# EAGLE schematic es (EAGLE 6.1)
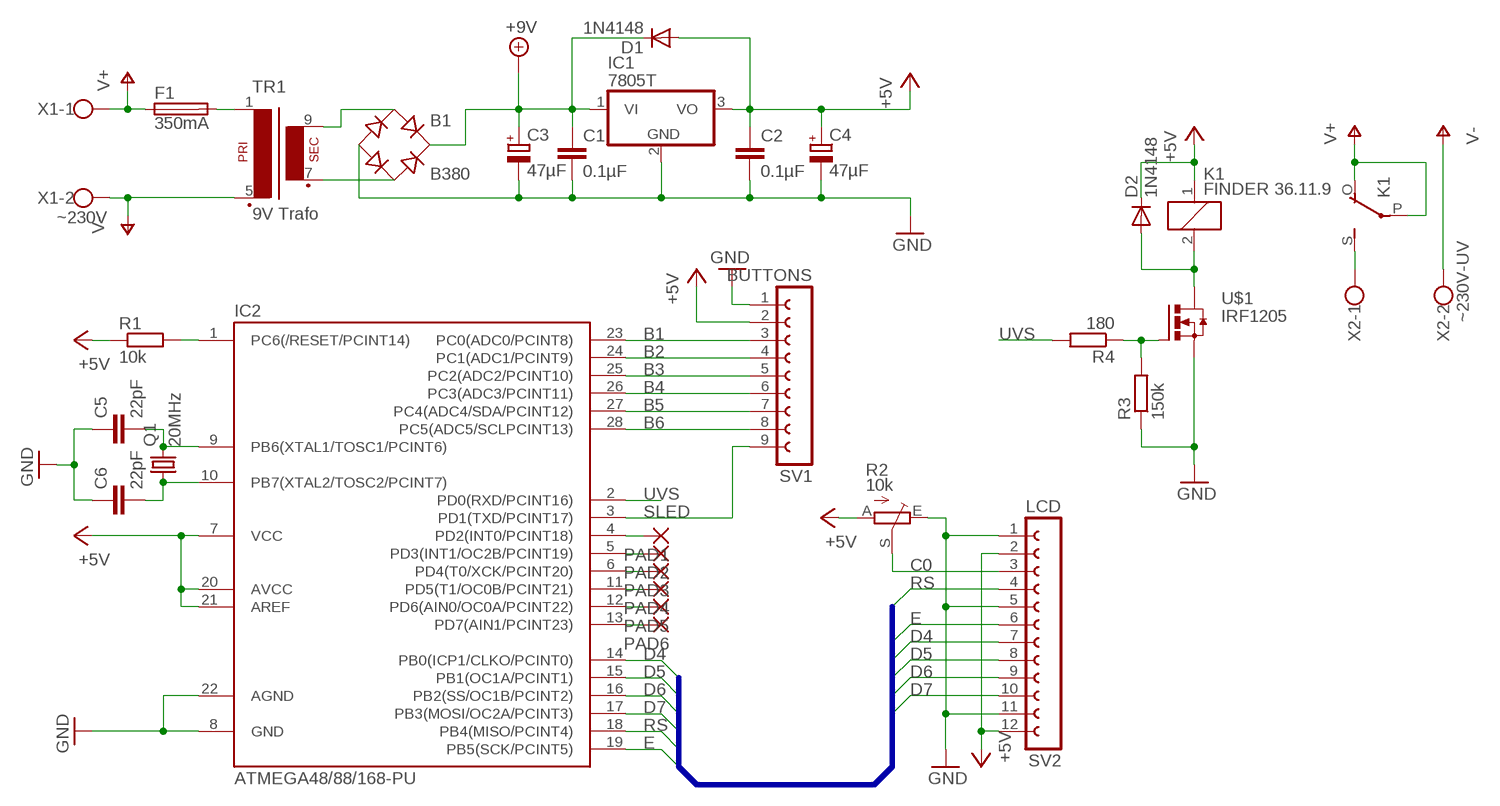
[diagram p0: schematic, sheet 1]

## Parts
B1  B380  RB1A  [RB1A]
C1  0.1µF  C-EU025-024X044  [C025-024X044]
C2  0.1µF  C-EU025-024X044  [C025-024X044]
C3  47µF  CPOL-EUE2.5-5  [E2,5-5]
C4  47µF  CPOL-EUE2.5-5  [E2,5-5]
C5  22pF  C-EU050-024X044  [C050-024X044]
C6  22pF  C-EU050-024X044  [C050-024X044]
D1  1N4148  1N4148DO35-7  [DO35-7]
D2  1N4148  1N4148DO35-7  [DO35-7]
F1  350mA  FUSESHK20Q  [SHK20Q]
IC1  7805T  [TO220H]
IC2  ATMEGA48/88/168-PU  [DIL28-3]
K1  FINDER 36.11.9  G5LE  [G5LE]
PAD1  1,6/0,8  [1,6/0,8]
PAD2  1,6/0,8  [1,6/0,8]
PAD3  1,6/0,8  [1,6/0,8]
PAD4  1,6/0,8  [1,6/0,8]
PAD5  1,6/0,8  [1,6/0,8]
PAD6  1,6/0,8  [1,6/0,8]
Q1  20MHz  CRYSTALHC49S  [HC49/S]
R1  10k  R-EU_0204/7  [0204/7]
R2  10k  TRIM_EU-LI15  [LI15]
R3  150k  R-EU_0204/7  [0204/7]
R4  180  R-EU_0204/7  [0204/7]
SV1  BUTTONS  FE09-1  [FE09]
SV2  LCD  FE12-1  [FE12]
TR1  9V Trafo  EI42-1  [EI42-1]
U$1  IRF1205  [I-PAK_TO251AA]
X1  ~230V  W237-2N  [W237-2N]
X2  ~230V-UV  W237-2N  [W237-2N]

## Nets
+5V: C2.1 C4.+ D1.A D2.C IC1.3(VO) IC2.7(VCC) IC2.20(AVCC) IC2.21(AREF) K1.1 R1.1 R2.A SV1.2 SV2.2 SV2.12
+9V: B1.+ C1.1 C3.+ D1.C IC1.1(VI)
B1: IC2.23(PC0(ADC0/PCINT8)) SV1.3
B2: IC2.24(PC1(ADC1/PCINT9)) SV1.4
B3: IC2.25(PC2(ADC2/PCINT10)) SV1.5
B4: IC2.26(PC3(ADC3/PCINT11)) SV1.6
B5: IC2.27(PC4(ADC4/SDA/PCINT12)) SV1.7
B6: IC2.28(PC5(ADC5/SCLPCINT13)) SV1.8
C0: R2.S SV2.3
D4: IC2.14(PB0(ICP1/CLKO/PCINT0)) SV2.7
D5: IC2.15(PB1(OC1A/PCINT1)) SV2.8
D6: IC2.16(PB2(SS/OC1B/PCINT2)) SV2.9
D7: IC2.17(PB3(MOSI/OC2A/PCINT3)) SV2.10
E: IC2.19(PB5(SCK/PCINT5)) SV2.6
GND: B1.- C1.2 C2.2 C3.- C4.- C5.1 C6.1 IC1.2(GND) IC2.8(GND) IC2.22(AGND) R2.E R3.1 SV1.1 SV2.1 SV2.5 SV2.11 U$1.3(S)
N$1: D2.A K1.2 U$1.2(D)
N$2: IC2.4(PD2(INT0/PCINT18)) PAD1.1(P)
N$3: C5.2 IC2.9(PB6(XTAL1/TOSC1/PCINT6)) Q1.2
N$4: B1.AC1 TR1.9(S4)
N$5: F1.2A TR1.1
N$6: K1.S(2:S) X2.1
N$7: B1.AC2 TR1.7(S3)
N$8: IC2.5(PD3(INT1/OC2B/PCINT19)) PAD2.1(P)
N$9: IC2.1(PC6(/RESET/PCINT14)) R1.2
N$10: C6.2 IC2.10(PB7(XTAL2/TOSC2/PCINT7)) Q1.1
N$11: IC2.6(PD4(T0/XCK/PCINT20)) PAD3.1(P)
N$12: IC2.11(PD5(T1/OC0B/PCINT21)) PAD4.1(P)
N$13: IC2.12(PD6(AIN0/OC0A/PCINT22)) PAD5.1(P)
N$14: IC2.13(PD7(AIN1/PCINT23)) PAD6.1(P)
N$15: R3.2 R4.1 U$1.1(G)
RS: IC2.18(PB4(MISO/PCINT4)) SV2.4
SLED: IC2.3(PD1(TXD/PCINT17)) SV1.9
UVS: IC2.2(PD0(RXD/PCINT16)) R4.2
V+: F1.1A K1.O(2:O) K1.P(2:P) X1.1
V-: TR1.5(P2) X1.2 X2.2

## Buses
RS,E,D4,D5,D6,D7

## Library data of the parts
B1 = rectifier:RB1A: RECTIFIER 1 A
C1 C2 C5 C6 = rcl:C-EU: CAPACITOR, European symbol
C3 C4 = rcl:CPOL-EU: POLARIZED CAPACITOR, European symbol
D1 D2 = diode:1N4148: DIODE high speed (Philips)
F1 = fuse:FUSE: Fuse; OC_FARNELL: unknown; OC_NEWARK: unknown
IC1 = linear:78*: Positive VOLTAGE REGULATOR Source: http://cache.national.com/ds/LM/LM78L05.pdf http://www.fairchildsemi.com/ds/LM/LM7805.pdf
IC2 = atmega8:ATMEGA48/88/168-PU
K1 = relay:G5LE: RELAY 1 x switch, 10 A/120 V AC, 8 A/30 V DC, Omron
PAD1-PAD6 = wirepad:1,6/0,8: THROUGH-HOLE PAD
Q1 = crystal:CRYSTAL: CRYSTAL
R1 R3 R4 = rcl:R-EU_: RESISTOR, European symbol
R2 = pot:TRIM_EU-: POTENTIOMETER
SV1 = con-lsta:FE09-1: FEMALE HEADER
SV2 = con-lsta:FE12-1: FEMALE HEADER
TR1 = trafo:EI42-1: TRANSFORMER 1 primary winding, 1 secondary winding ERA
U$1 = transistor-power:IRF1205: HEXFET Power MOSFET Source: http://www.irf.com/product-info/datasheets/data/irfr1205.pdf
X1 X2 = con-wago-508:W237-2N: WAGO SREW CLAMP